# Altium schematic sheet Switch.SchDoc
size B; Organization: MASA; SheetNumber: 5; SheetTotal: 6
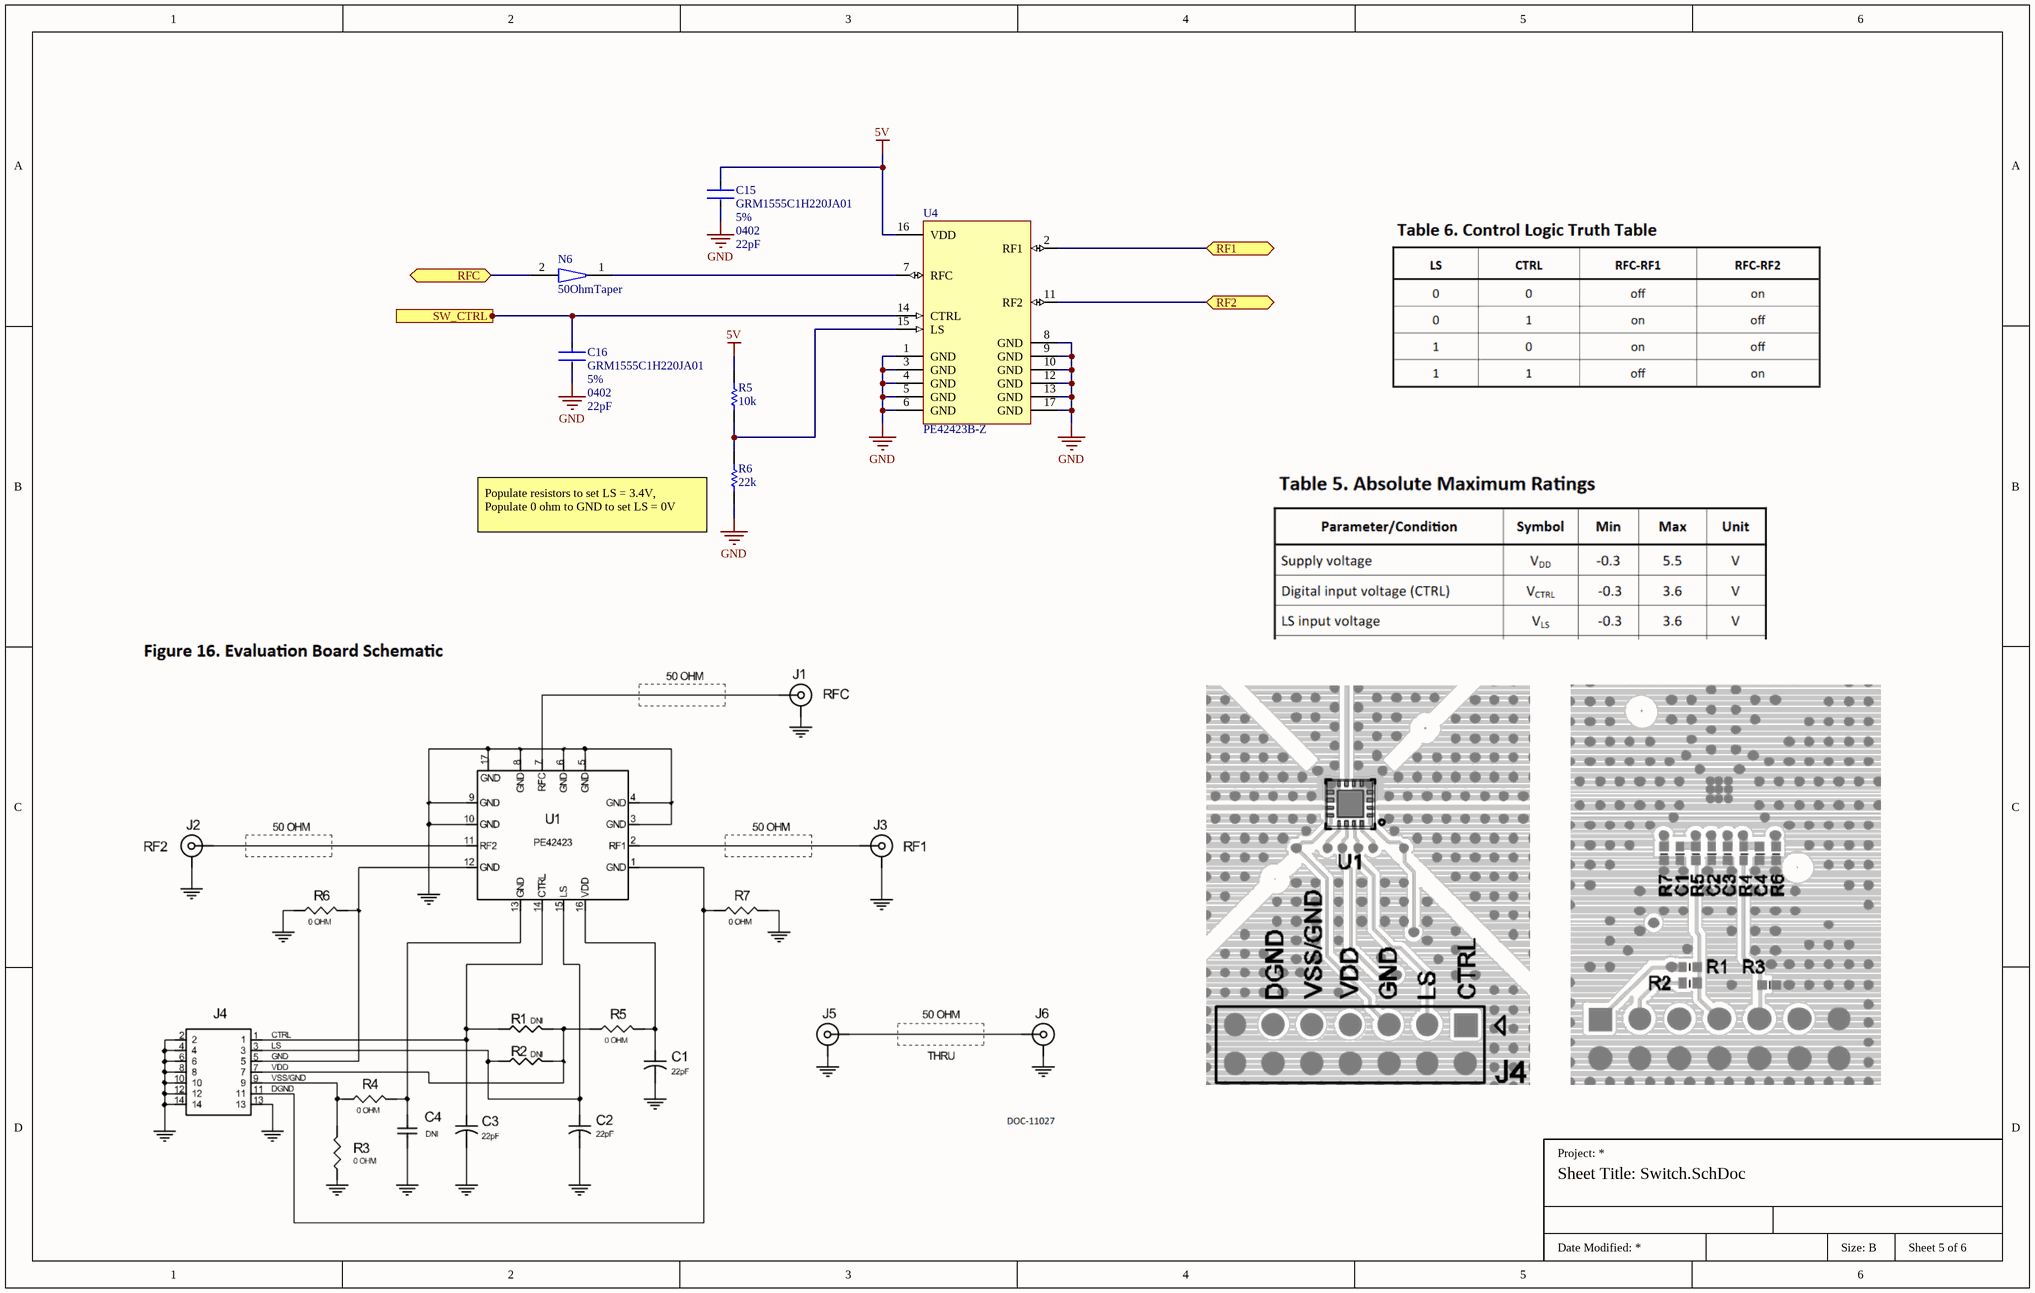
[diagram p0: Switch.SchDoc]

## Parts
C15  GRM1555C1H220JA01  value 22pF  Tolerance: 5%  Package: 0402  [Capacitor0402_Murata]
C16  GRM1555C1H220JA01  value 22pF  Tolerance: 5%  Package: 0402  [Capacitor0402_Murata]
N6  50OhmTaper  [50OhmTaper]  (net tie, no BOM)
R5  value 10k  [RESC1608X55X25NL10T15]  (hidden comment: RC0603FR-072K2L)
R6  value 22k  [RESC1608X55X25NL10T15]  (hidden comment: RC0603FR-072K2L)
U4  PE42423B-Z  [PE42423-QFN127P600-8N]

## Ports
RF1 (bidir), RF2 (bidir), RFC (bidir), SW_CTRL (in)

## Nets
5V: C15.1 R5.2 U4.16(VDD)
GND: C15.2 C16.2 R6.1 U4.1(GND) U4.3(GND) U4.4(GND) U4.5(GND) U4.6(GND) U4.8(GND) U4.9(GND) U4.10(GND) U4.12(GND) U4.13(GND) U4.17(GND)
RF1: U4.2(RF1) ; port RF1
RF2: U4.11(RF2) ; port RF2
RFC: N6.2 ; port RFC
SW_CTRL: C16.1 U4.14(CTRL) ; port SW_CTRL
NetN6_1: N6.1 U4.7(RFC)
NetR5_1: R5.1 R6.2 U4.15(LS)

## Notes on the sheet
- (near R6) Populate resistors to set LS = 3.4V,
  Populate 0 ohm to GND to set LS = 0V
- Size: B

## Library data of the parts
C15 C16 = GRM1555C1H220JA01: 22 pF ±5% 50V Ceramic Capacitor C0G, NP0 0402 (1005 Metric); Automotive Grade: Grade 1; Temperature Characteristic: X7R; RoHS: TRUE; Material: Ceramic; Temperature Range High: +125°C; Lead Free: Yes; Category: Cap; ComponentLink2Description: Datasheet; Temperature Range Low: -55°C; Device Class L1: Passive Components; Voltage Rating: 50 V; Automotive: Yes; Device Class L3: Ceramic Capacitors; ComponentLink2URL: https://api.kemet.com/component-edge/download/datasheet/C0603C100J5GACAUTO.pdf; Device Class L2: Capacitors; Supplier 1: Avnet; Supplier Part Number 1: GRM1555C1H220JA01D
N6 = 50OhmTaper: Triangular taper from 50 Ohms to 0402 width
R5 R6 = Resistor 0603: Thick Film Resistor, 2.2 KOhm, 100 mW, 50 V, +/- 1%, -55 to 155 degC, 2-Pin SMD (0603), RoHS, Tape and Reel; Manufacturer: Yageo; Temperature Coefficient: 100PPM/C; Voltage Rating: 50V; Power Rating: 100mW; Tolerance: 1%; Datasheet Version: Rev. 7, 05/2017; Case Code - mm: 1608; Series: RC; Mounting Technology: SurfaceMount; Package Description: 2-Pin Surface Mount Device, Body 1.6 x 0.8 mm; Case Code - in: 0603; Package Reference: 0603; Product: ThickFilmResistorsGeneralPurpose; Manufacturer URL: http://www.yageo.com/; Termination Style: SMD/SMT; Operating Temperature Range: -55Cto+155C; Datasheet URL: http://www.yageo.com/documents/recent/PYu-RC_Group_51_RoHS_L_7.pdf; Packaging: Reel
U4 = PE42423B-Z: RF Switch IC 802.11a/b/g/n/ac SPDT 6 GHz 50Ohm 16-QFN (3x3); Supplier 1: Digikey; Supplier Part Number 1: 1046-1103-1-ND